# Altium schematic sheet 10_LED.SchDoc
size A4
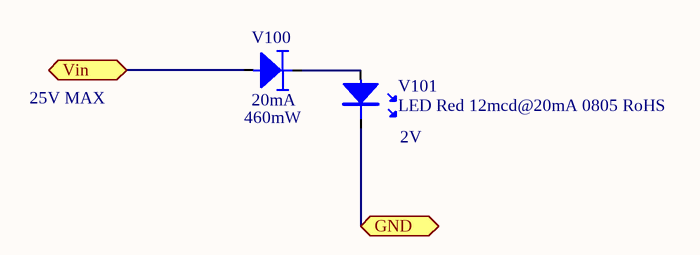
[diagram p0: 10_LED.SchDoc]

## Parts
V100  20mA  [SOD123]
V101  LED Red 12mcd@20mA 0805 RoHS  [LED-0805]

## Ports
GND, Vin

## Nets
GND: V101.k ; port GND
Vin: V100.a ; port Vin
NetV100_k: V100.k V101.a

## Notes on the sheet
- 25V MAX
- (near V100) 460mW
- (near V101) 2V

## Library data of the parts
V100 = 9913: CURRENT REG; Part Field 1: IC CONSTANT CURRENT REG 15MA 460mW; Manufacturer: On Semiconductor; PartNumber: NSI45015WT1G; IPN: 9913; Characteristics: 20MA 45V 460mW RoHS; Lead_Process_Compatible: Yes; SubmittedBy: zmze; DeviceRank: 2; Part Field 2: On Semiconductor NSI45015WT1G; ComponentLink1Description: On Semiconductor_NSI45015WT1G_NSI45015W-D.PDF; ComponentLink2Description: Compliant; ComponentLink1URL: http://ecad.vsl.com.au/apps/BomGen/Data/rel/datasheets/On Semiconductor/On Semiconductor_NSI45015WT1G_NSI45015W-D.PDF; Altium_Comment_Old: IC CONSTANT CURRENT REG 15MA 460mW; Altium_Comment: 20mA; Symbol: AL5809; LastChanged: 12/08/16 11:28:58; Supplier1: DigiKey; Supplier1_PartNumber: NSI45015WT1GOSCT-ND; IPN_Search: 9913; OrderNumber: NSI45015WT1G; PartType: PCB
V101 = 2785: LED; Manufacturer: Kingbright; PartNumber: KP-2012EC; IPN: 2785; EndOfLife: Active EOL:Jun 2020; Characteristics: Wpk=627nm Vftyp=2V Vfmax=2.5V Ifmax=30mA -40..+85 View angle=120deg; Lead_Process_Compatible: Yes; SubmittedBy: LGG; DeviceRank: 2; Part Field 1: LED Red 12mcd@20mA 0805 RoHS; Part Field 2: Kingbright KP-2012EC; ComponentLink1Description: Kingbright_KP-2012EC_DS.pdf; ComponentLink2Description: Kingbright_KPseries_RCS.pdf; ComponentLink1URL: http://ecad.vsl.com.au/apps/BomGen/Data/rel/datasheets/new_parts/Kingbright_KP-2012EC_DS.pdf; ComponentLink2URL: http://ecad.vsl.com.au/apps/BomGen/Data/rel/rohs_compliance/new_certificates/Kingbright_KPseries_RCS.pdf; Altium_Comment_Old: LED Red 12mcd@20mA 0805 RoHS; Altium_Comment: LED Red 12mcd@20mA 0805 RoHS; Symbol: LED; LastChanged: 27/06/08 15:06:33; Supplier1: Tenrod; Supplier1_PartNumber: KP-2012EC; Supplier2: Farnell; Supplier2_PartNumber: 8529949; IPN_Search: 2785; OrderNumber: KP-2012EC; PartType: PCB; Price: 0.08; CheckedBy: ART